# Altium schematic sheet HV power supply.SchDoc
size A4; SheetNumber: 1; SheetTotal: 4
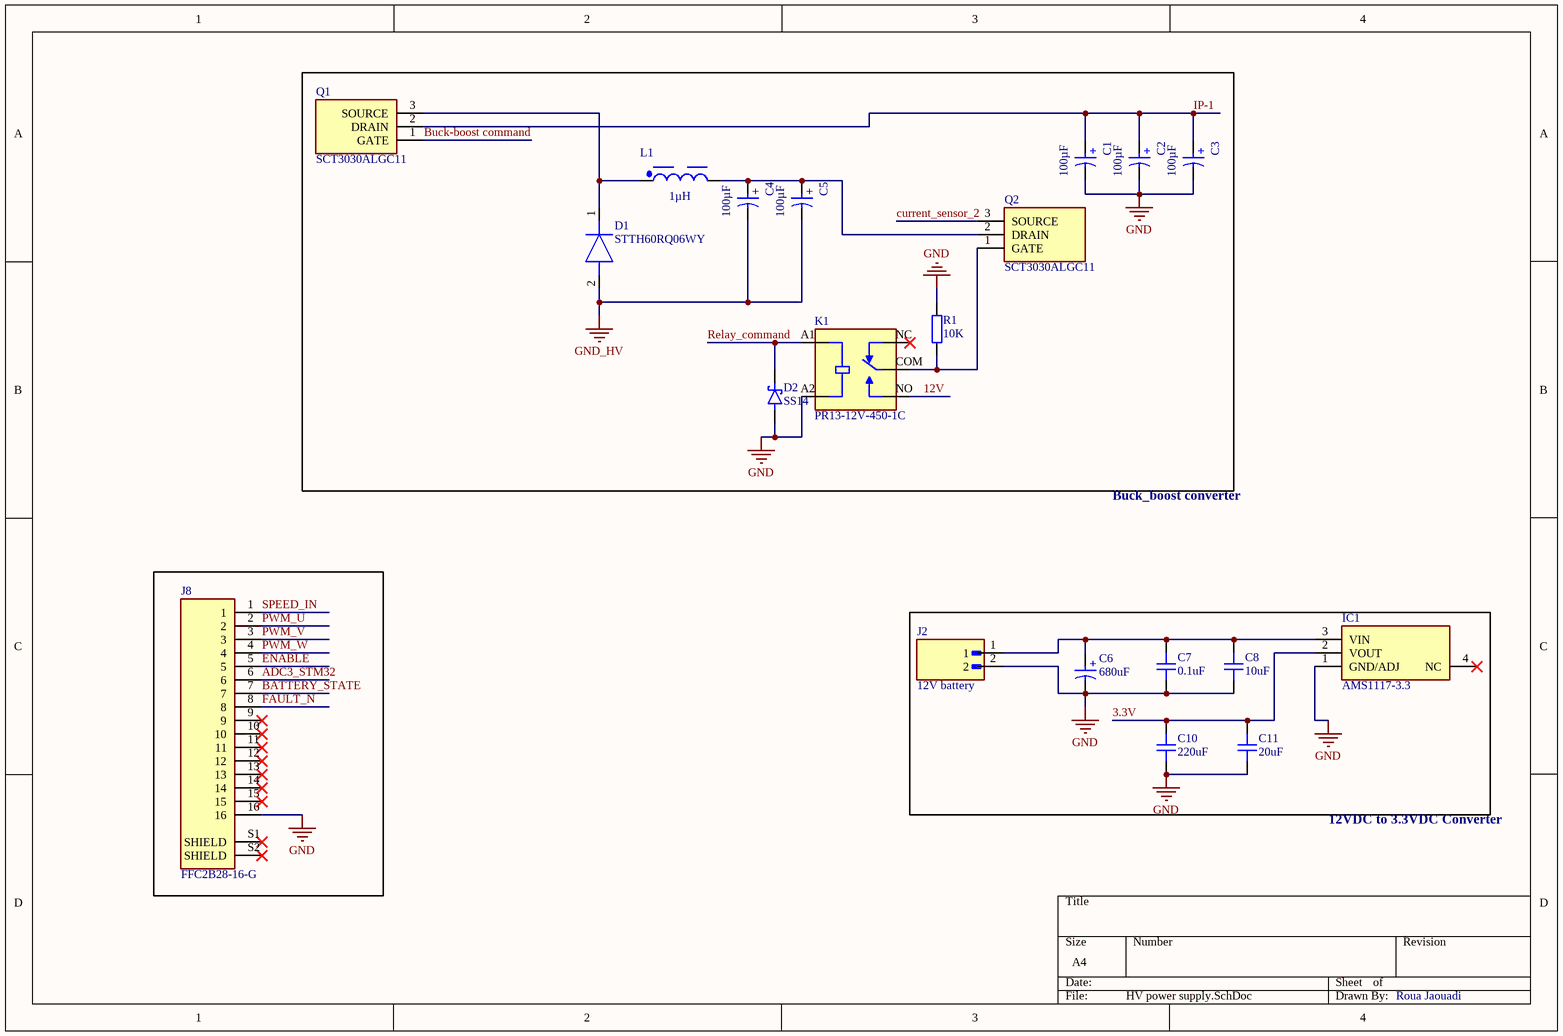
[diagram p0: HV power supply.SchDoc]

## Parts
C1  100µF  [WCAP-AT1H_D16H35.5]
C2  100µF  [WCAP-AT1H_D16H35.5]
C3  100µF  [WCAP-AT1H_D16H35.5]
C4  100µF  [WCAP-AT1H_D16H35.5]
C5  100µF  [WCAP-AT1H_D16H35.5]
C6  680uF  [WCAP-ATG8_D8H16]
C7  0.1uF  [CAP_0603]
C8  10uF  [CAP_1206]
C10  220uF  [CAP-EL-NP-5MM]
C11  20uF  [CAP_1206]
D1  STTH60RQ06WY  [TO1090P515X1560X2445-2P]
D2  SS14  [DIOM4325X250N]
IC1  AMS1117-3.3  [SOT229P700X180-4N]
J2  12V battery  [JST_S2B-XH-A(LF)(SN)]
J8  FFC2B28-16-G  [GCT_FFC2B28-16-G]
K1  PR13-12V-450-1C  [RELAY_PR13-12V-450-1C]
L1  1µH  [WE-HCFT_2504_7443762504010]
Q1  SCT3030ALGC11  [TO545P515X1600X2535-3P]
Q2  SCT3030ALGC11  [TO545P515X1600X2535-3P]
R1  10K  [RES_0603]

## Nets
GND: C1.2(N) C2.2(N) C3.2(N) C6.2(N) C7.2 C8.2 C10.2 C11.2 D2.A IC1.1(GND/ADJ) J2.2 J8.16 K1.A2(COIL2) R1.1
GND_HV: C4.2(N) C5.2(N) D1.2(A)
3.3V: C10.1 C11.1 IC1.2(VOUT)
12V: K1.NO
ADC3_STM32: J8.6
BATTERY_STATE: J8.7
Buck-boost command: Q1.1(GATE)
current_sensor_2: Q2.3(SOURCE)
ENABLE: J8.5
FAULT_N: J8.8
IP-1: C1.1(P) C2.1(P) C3.1(P) Q1.2(DRAIN)
PWM_U: J8.2
PWM_V: J8.3
PWM_W: J8.4
Relay_command: D2.C(K) K1.A1(COIL1)
SPEED_IN: J8.1
NetC4_1: C4.1(P) C5.1(P) L1.2 Q2.2(DRAIN)
NetC6_1: C6.1(P) C7.1 C8.1 IC1.3(VIN) J2.1
NetD1_1: D1.1(K) L1.1 Q1.3(SOURCE)
NetK1_COM: K1.COM Q2.1(GATE) R1.2

Not connected (* = marked no-connect by the designer): IC1 4(NC)*; J8 9* 10* 11* 12* 13* 14* 15* S1(SHIELD)* S2(SHIELD)*; K1 NC*

## Notes on the sheet
- Buck_boost converter
- 12VDC to 3.3VDC Converter
- Roua Jaouadi
- (in symbol 860010374014) +
- (in symbol 860241480001) +

## Library data of the parts
C1-C5 = 860241480001: WCAP-AT1H Aluminum Electrolytic Capacitor, Radial, D16 x H35.5mm, 100µF, 450V; Manufacturer: Wurth Elektronik; Capacitance Tolerance: +/-20%; Dissipation Factor: 17%; Endurance: 5000h; Leakage Current: 1900µA; Ripple Current: 610mA; Technical Reference: ATJK355101M450DSPADE000; Manufacturer Part Number: 860241480001; Category: Aluminum Electrolytic Capacitors; Match Code: WCAP-AT1H; ComponentLink1Description: Website Link; ComponentLink1URL: https://www.we-online.com/redexpert/article/860241480001?ad; ComponentLink2Description: Datasheet Link; ComponentLink2URL: https://www.we-online.com/redexpert/spec/860241480001?ad; Mount: Through Hole; Min Operating Temperature: -25°C; Max Operating Temperature: 105°C; Packaging: Ammo Pack; Case/Size Code: D16 x H35.5mm; Height: 35.5mm; Diameter: 16mm; Capacitance: 100µF; Rated Voltage (DC): 450V
C6 = 860010374014: WCAP-ATG8 Aluminum Electrolytic Capacitor, Radial, THT, D8 x H16mm, 680uF, 16V; Manufacturer: Wurth Elektronik; Capacitance Tolerance: +/-20%; Dissipation Factor: 16%; Endurance: 2000h; Leakage Current: 108.8uA; Ripple Current: 640mA; Technical Reference: ATBE160681M016DSPA7B000; Manufacturer Part Number: 860010374014; Category: Aluminum Electrolytic Capacitors; Match Code: WCAP-ATG8; ComponentLink1Description: Website Link; ComponentLink1URL: https://www.we-online.com/redexpert/article/860010374014?ad; ComponentLink2Description: Datasheet Link; ComponentLink2URL: https://www.we-online.com/redexpert/spec/860010374014?ad; Mount: Through Hole; Operating Temperature Max: 85°C; Operating Temperature Min: -40°C; Packaging: Ammo Pack; Height: 16mm; Diameter: 8mm; Capacitance: 680uF; Rated Voltage (DC): 16V
C7 = CAP_0603: Capacitor SMD 0603; Manufacturer: *; Manufacturer Part Number: *; Distributor Link: *; LCSC: *; Rating: *; Dielectric: *
C8 C11 = CAP_1206: Capacitor SMD 1206; Manufacturer: *; Manufacturer Part Number: *; Distributor Link: *; LCSC: *; Rating: *; Dielectric: *
C10 = CAP_EL_NP_5MM: Capacitor SMD Electrolytic Non-Polarised 5mm Diameter; Manufacturer: Nichicon; Manufacturer Part Number: *
D1 = STTH60RQ06WY: Diode; Manufacturer_Name: STMicroelectronics; Datasheet Link: https://www.st.com/resource/en/datasheet/stth60rq06-y.pdf; Height: 5.15mm; Manufacturer_Part_Number: STTH60RQ06WY; Mouser Part Number: 511-STTH60RQ06WY; Mouser Price/Stock: https://www.mouser.co.uk/ProductDetail/STMicroelectronics/STTH60RQ06WY?qs=MLItCLRbWsyVCwranNoGkg%3D%3D
D2 = SS14: 1A, 40V, Schottky Rectifier; MF: Taiwan Semiconductor; SnapEDA_Link: https://www.snapeda.com/parts/SS14/taiwan/view-part/?ref=snap; Package: SMA-2 Taiwan Semiconductor; Value: *; MP: SS14; Check_prices: https://www.snapeda.com/parts/SS14/taiwan/view-part/?ref=eda
IC1 = AMS1117-3.3: Integrated Circuit; Manufacturer_Name: Advanced; Datasheet Link: https://datasheet.datasheetarchive.com/originals/distributors/Datasheets-28/DSA-550594.pdf; Height: 1.8mm; Manufacturer_Part_Number: AMS1117-3.3
J2 = S2B-XH-A(LF)(SN): Connector Header Through Hole, Right Angle 2 position 0.098 (2.50mm); MF: JST Sales; SnapEDA_Link: https://www.snapeda.com/parts/S2B-XH-A(LF)(SN)/JST/view-part/?ref=snap; Package: None; Value: *; MP: S2B-XH-A(LF)(SN); Check_prices: https://www.snapeda.com/parts/S2B-XH-A(LF)(SN)/JST/view-part/?ref=eda
J8 = FFC2B28-16-G: 16 Position FFC, FPC Connector Contacts, Top and Bottom 0.020 (0.50mm) Surface Mount, Right Angle; MF: Global Connector Technology; SnapEDA_Link: https://www.snapeda.com/parts/FFC2B28-16-G/Global+Connector+Technology/view-part/?ref=snap; Package: None; Value: *; MP: FFC2B28-16-G; Check_prices: https://www.snapeda.com/parts/FFC2B28-16-G/Global+Connector+Technology/view-part/?ref=eda
K1 = PR13-12V-450-1C: 19 x 15.5 x 15.8 mm, 12 V, 10 A, SPDT (1 Form C), Power Relay; MF: Same Sky; SnapEDA_Link: https://www.snapeda.com/parts/PR13-12V-450-1C/Same+Sky/view-part/?ref=snap; Package: None; Value: *; MP: PR13-12V-450-1C; Check_prices: https://www.snapeda.com/parts/PR13-12V-450-1C/Same+Sky/view-part/?ref=eda
L1 = 7443762504010: WE-HCFT THT High Current Inductor, size 2504, 1µH, 39A; Manufacturer: Wurth Elektronik; Case/Size Code: 2504; DC Resistance: 0.86mΩ; DC Resistance Max: 0.95mΩ; Inductance Tolerance: 20%; Saturation Current: 33A; Self Resonant Frequency: 38MHz; Manufacturer Part Number: 7443762504010; Category: Power Inductors; Match Code: WE-HCFT; ComponentLink1Description: Website Link; ComponentLink1URL: https://www.we-online.com/redexpert/article/7443762504010?ad; ComponentLink2Description: Datasheet Link; ComponentLink2URL: https://www.we-online.com/redexpert/spec/7443762504010?ad; Mount: Through Hole; Min Operating Temperature: -40°C; Max Operating Temperature: 125°C; Packaging: Tray; Length: 22mm; Width: 25.7mm; Height: 4.1mm; Inductance: 1µH; Rated Current: 39A
Q1 Q2 = SCT3030ALGC11: Transistor; Manufacturer_Name: ROHM Semiconductor; Datasheet Link: https://datasheet.datasheetarchive.com/originals/distributors/DKDS-18/357094.pdf; Height: 5.15mm; Manufacturer_Part_Number: SCT3030ALGC11; Mouser Part Number: 755-SCT3030ALGC11; Mouser Price/Stock: https://www.mouser.co.uk/ProductDetail/ROHM-Semiconductor/SCT3030ALGC11?qs=tlR8i4ZVbUfmf0QVOgVHPA%3D%3D
R1 = RES_0603: Resistor SMD 0603; Manufacturer: *; Manufacturer Part Number: *; Distributor Link: *; LCSC: *